# EAGLE schematic RPI 4B HAT schematic (EAGLE 9.7.0)

## Sheet 1 of 5
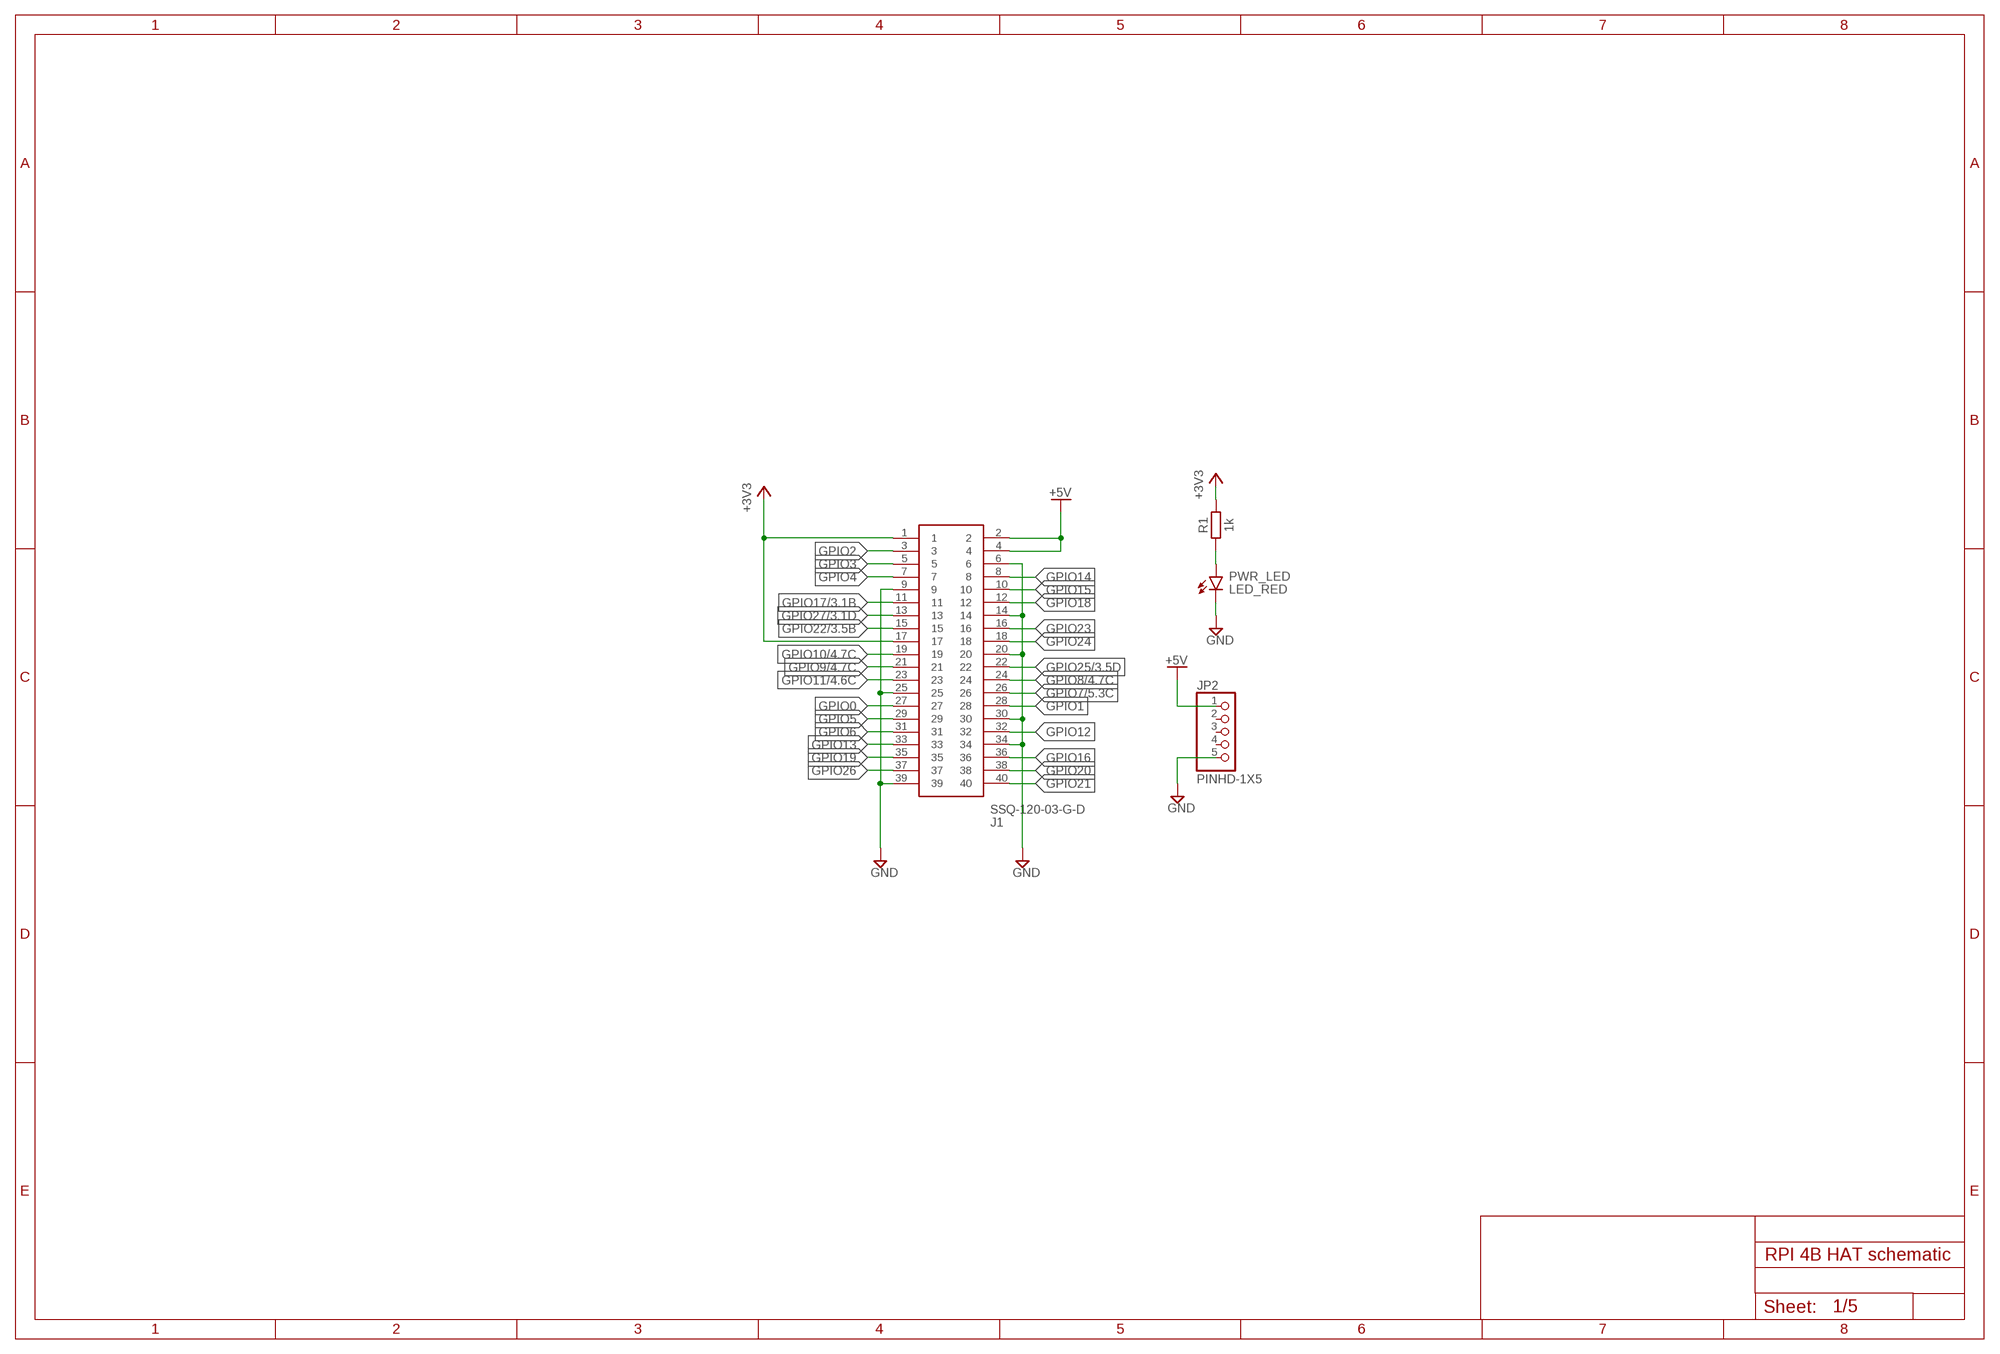
[diagram p0: schematic, sheet 1]

### Parts
J1  SSQ-120-03-G-D  [SSQ-120-XX-YYY]
JP2  PINHD-1X5  [1X05]
PWR_LED  LED_RED  CHIP-FLAT-R_1206  [LEDC3216X75N_FLAT-R]
R1  1k  RESISTOR__CHIP-1206(3216-METRIC)  [RESC3216X70]

### Nets
+3V3: J1.1 J1.17 R1.2
+5V: J1.2 J1.4 JP2.1 ; also sheet 2,3,4,5
GND: J1.6 J1.9 J1.14 J1.20 J1.25 J1.30 J1.34 J1.39 JP2.5 PWR_LED.C ; also sheet 2,3,4,5
GPIO0: J1.27
GPIO1: J1.28
GPIO2: J1.3
GPIO3: J1.5
GPIO4: J1.7
GPIO5: J1.29
GPIO6: J1.31
GPIO7: J1.26 ; also sheet 5
GPIO8: J1.24 ; also sheet 4
GPIO9: J1.21 ; also sheet 4
GPIO10: J1.19 ; also sheet 4,5
GPIO11: J1.23 ; also sheet 4,5
GPIO12: J1.32
GPIO13: J1.33
GPIO14: J1.8
GPIO15: J1.10
GPIO16: J1.36
GPIO17: J1.11 ; also sheet 3
GPIO18: J1.12
GPIO19: J1.35
GPIO20: J1.38
GPIO21: J1.40
GPIO22: J1.15 ; also sheet 3
GPIO23: J1.16
GPIO24: J1.18
GPIO25: J1.22 ; also sheet 3
GPIO26: J1.37
GPIO27: J1.13 ; also sheet 3
N$5: PWR_LED.A R1.1
Unconnected: JP2.2 JP2.3 JP2.4

## Sheet 2 of 5
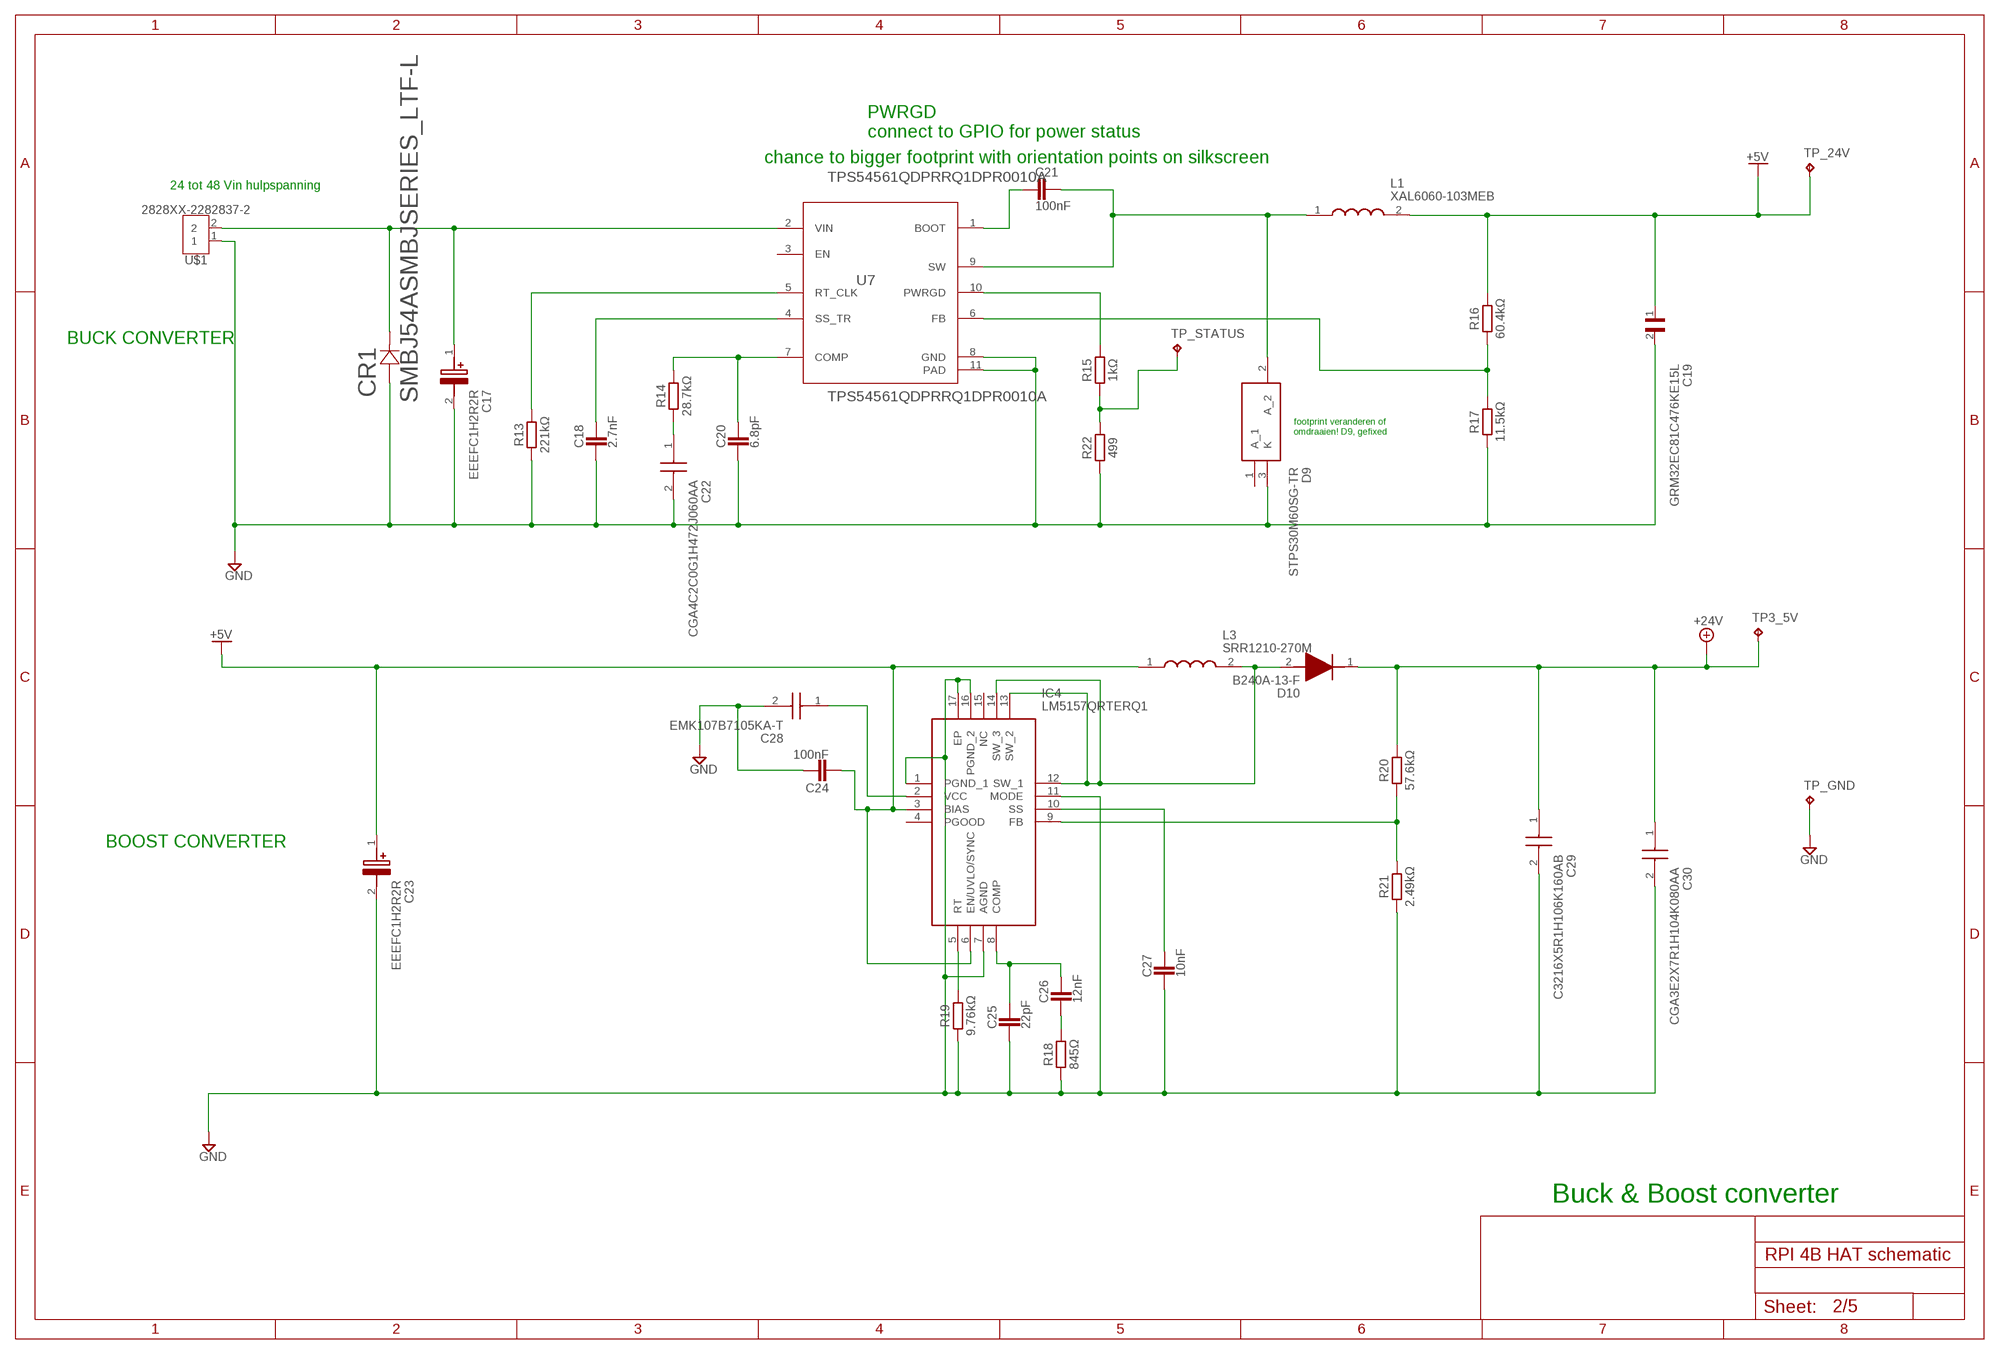
[diagram p1: schematic, sheet 2]

### Parts
C17  EEEFC1H2R2R  [EEE1AA220WR]
C18  2.7nF  CAPACITOR_CHIP-1206(3216-METRIC)  [CAPC3216X135]
C19  GRM32EC81C476KE15L  [CAPC3225X270N]
C20  6.8pF  CAPACITOR_CHIP-1206(3216-METRIC)  [CAPC3216X135]
C21  100nF  CAPACITOR_CHIP-1206(3216-METRIC)  [CAPC3216X135]
C22  CGA4C2C0G1H472J060AA  [CAPC2012X75N]
C23  EEEFC1H2R2R  [EEE1AA220WR]
C24  100nF  CAPACITOR_CHIP-1206(3216-METRIC)  [CAPC3216X135]
C25  22pF  CAPACITOR_CHIP-1206(3216-METRIC)  [CAPC3216X135]
C26  12nF  CAPACITOR_CHIP-1206(3216-METRIC)  [CAPC3216X135]
C27  10nF  CAPACITOR_CHIP-1206(3216-METRIC)  [CAPC3216X135]
C28  EMK107B7105KA-T  [CAPC1608X90N]
C29  C3216X5R1H106K160AB  [CAPC3216X180N]
C30  CGA3E2X7R1H104K080AA  [CAPC1608X90N]
CR1  SMBJ54ASMBJSERIES_LTF-L  [SMBJSERIES_LTF-L]
D9  STPS30M60SG-TR  [T1210T8G]
D10  B240A-13-F  [DIOM5226X230N]
IC4  LM5157QRTERQ1  [QFN50P300X300X80-17N]
L1  XAL6060-103MEB  [XAL6060-103MEB]
L3  SRR1210-270M  [SRR1210]
R13  221kΩ  RESISTOR__CHIP-1206(3216-METRIC)  [RESC3216X70]
R14  28.7kΩ  RESISTOR__CHIP-1206(3216-METRIC)  [RESC3216X70]
R15  1kΩ  RESISTOR__CHIP-1206(3216-METRIC)  [RESC3216X70]
R16  60.4kΩ  RESISTOR__CHIP-1206(3216-METRIC)  [RESC3216X70]
R17  11.5kΩ  RESISTOR__CHIP-1206(3216-METRIC)  [RESC3216X70]
R18  845Ω  RESISTOR__CHIP-1206(3216-METRIC)  [RESC3216X70]
R19  9.76kΩ  RESISTOR__CHIP-1206(3216-METRIC)  [RESC3216X70]
R20  57.6kΩ  RESISTOR__CHIP-1206(3216-METRIC)  [RESC3216X70]
R21  2.49kΩ  RESISTOR__CHIP-1206(3216-METRIC)  [RESC3216X70]
R22  499  RESISTOR__CHIP-1206(3216-METRIC)  [RESC3216X70]
TP3_5V  TPB1,27  [B1,27]
TP_24V  TPB1,27  [B1,27]
TP_GND  TPB1,27  [B1,27]
TP_STATUS  TPB1,27  [B1,27]
U7  TPS54561QDPRRQ1DPR0010A  [DPR0010A]
U$1  2828XX-2282837-2  [TERMBLK_508-2N]

### Nets
+5V: C19.1 C23.1(+) C24.2 IC4.3(BIAS) IC4.6(EN/UVLO/SYNC) L1.2 L3.1 R16.2 TP_24V.TP ; also sheet 1,3,4,5
+24V: C29.1 C30.1 D10.1(K) R20.2 TP3_5V.TP ; also sheet 3,4
GND: C17.2(-) C18.2 C19.2 C20.2 C22.2 C23.2(-) C24.1 C25.2 C27.2 C28.2 C29.2 C30.2 CR1.2 D9.3(K) IC4.1(PGND_1) IC4.7(AGND) IC4.11(MODE) IC4.16(PGND_2) IC4.17(EP) R13.1 R17.1 R18.1 R19.1 R21.1 R22.1 TP_GND.TP U7.8(GND) U7.11(PAD) U$1.1 ; also sheet 1,3,4,5
N$22: C17.1(+) CR1.1 U7.2(VIN) U$1.2
N$23: R13.2 U7.5(RT_CLK)
N$24: C18.1 U7.4(SS_TR)
N$25: C22.1 R14.1
N$26: C20.1 R14.2 U7.7(COMP)
N$27: C21.2 U7.1(BOOT)
N$28: C21.1 D9.2(A_2) L1.1 U7.9(SW)
N$29: R15.2 U7.10(PWRGD)
N$30: R16.1 R17.2 U7.6(FB)
N$31: C28.1 IC4.2(VCC)
N$32: C25.1 C26.1 IC4.8(COMP)
N$33: C26.2 R18.2
N$34: C27.1 IC4.10(SS)
N$35: IC4.5(RT) R19.2
N$36: D10.2(A) IC4.12(SW_1) IC4.13(SW_2) IC4.14(SW_3) L3.2
N$37: IC4.9(FB) R20.1 R21.2
N$38: R15.1 R22.2 TP_STATUS.TP
Unconnected: D9.1(A_1) IC4.4(PGOOD) IC4.15(NC) U7.3(EN)

### Notes on the sheet
- PWRGD 
  connect to GPIO for power status
- chance to bigger footprint with orientation points on silkscreen
- 24 tot 48 Vin hulpspanning
- BUCK CONVERTER
- footprint veranderen of
  omdraaien! D9, gefixed
- BOOST CONVERTER
- Buck & Boost converter

## Sheet 3 of 5
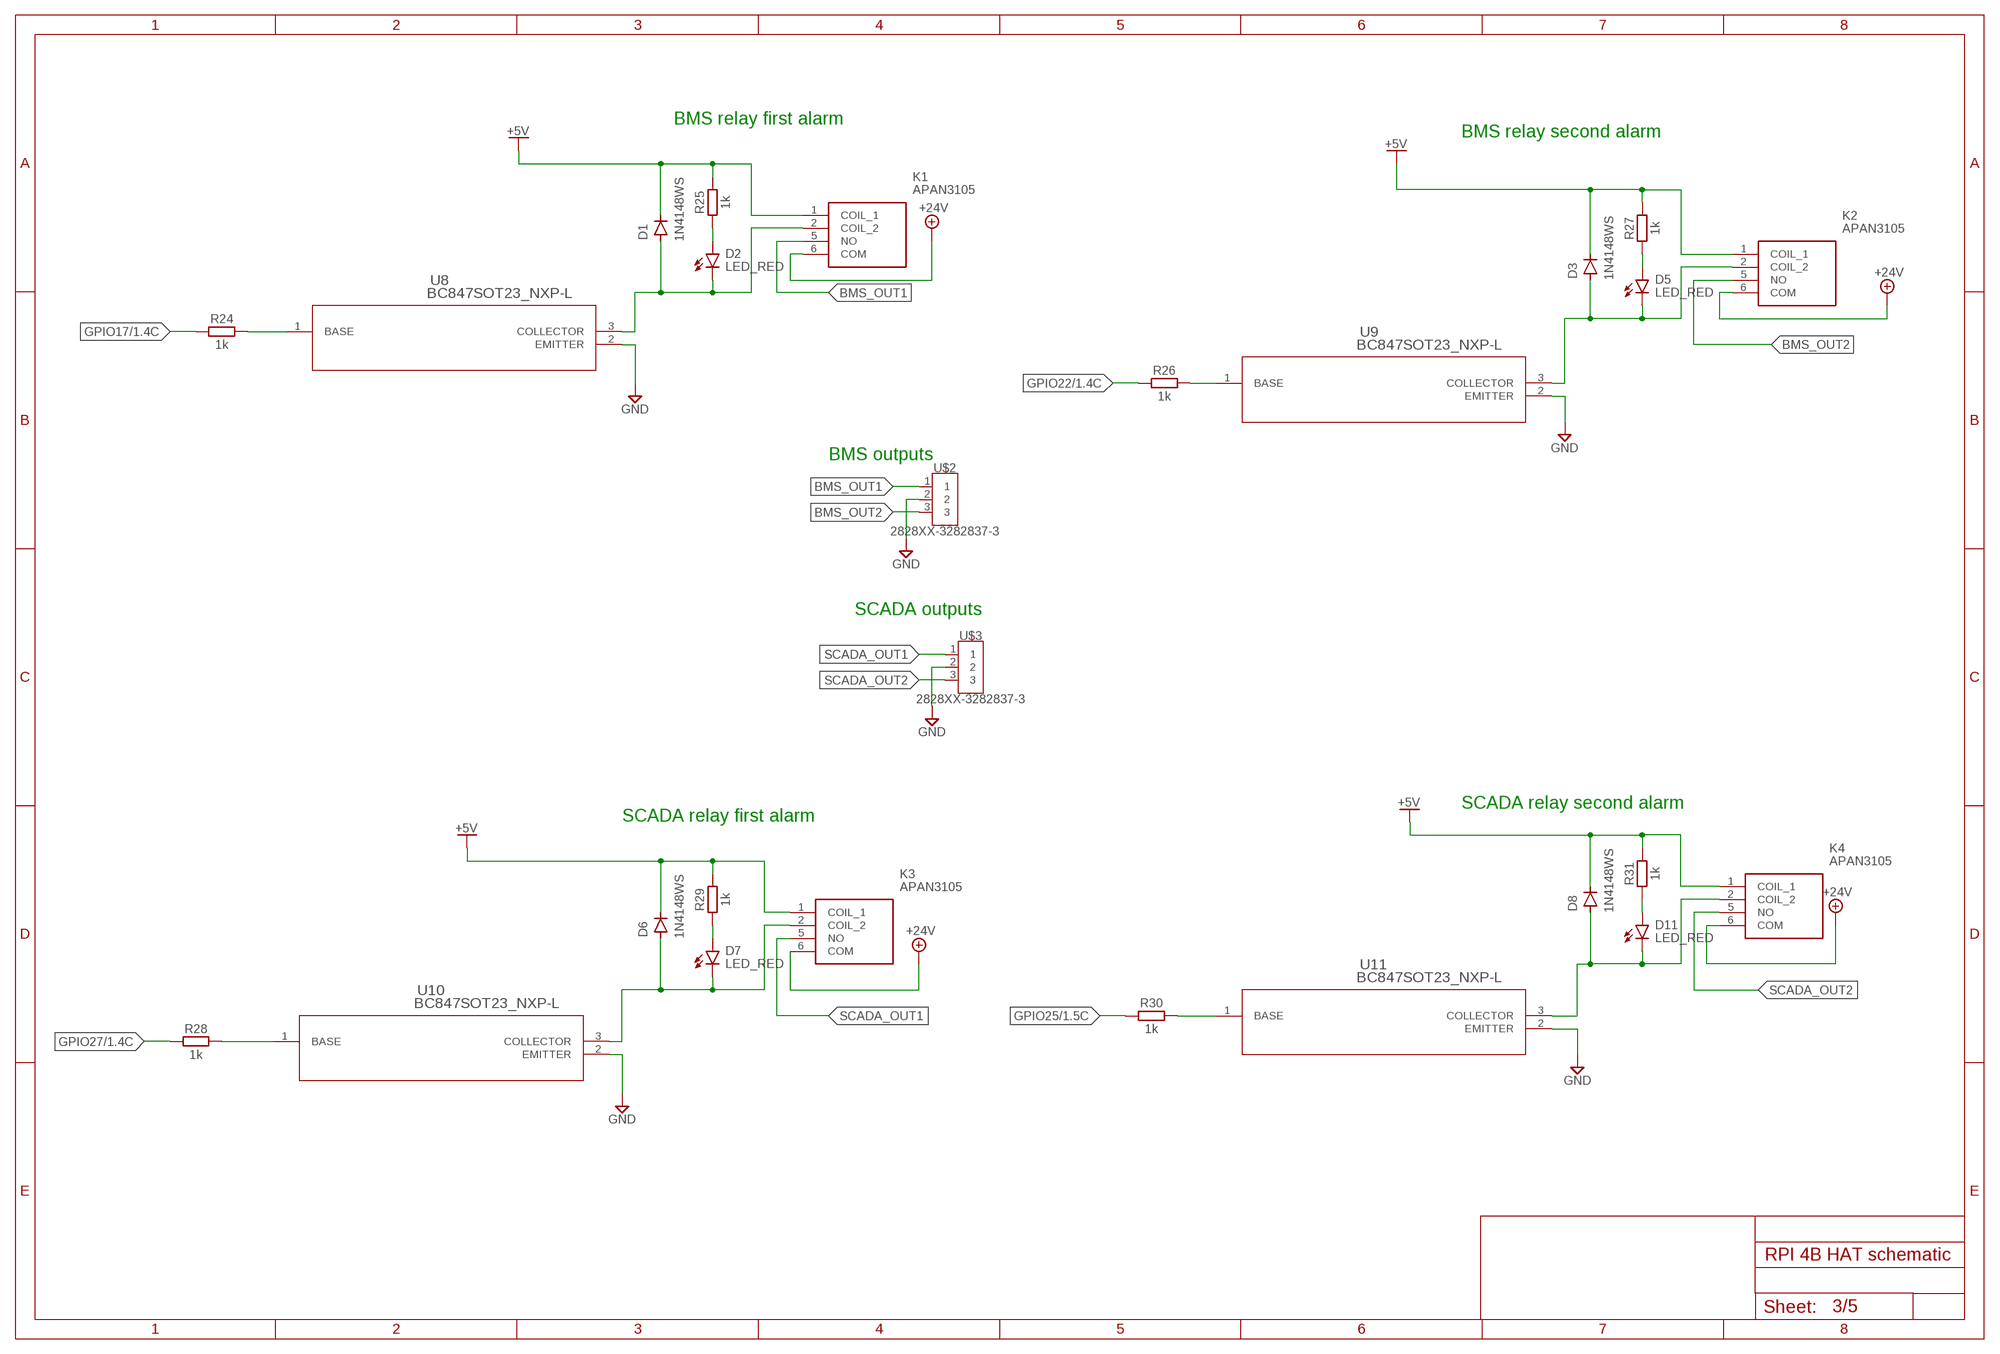
[diagram p2: schematic, sheet 3]

### Parts
D1  1N4148WS  [SOD-323]
D2  LED_RED  CHIP-FLAT-R_1206  [LEDC3216X75N_FLAT-R]
D3  1N4148WS  [SOD-323]
D5  LED_RED  CHIP-FLAT-R_1206  [LEDC3216X75N_FLAT-R]
D6  1N4148WS  [SOD-323]
D7  LED_RED  CHIP-FLAT-R_1206  [LEDC3216X75N_FLAT-R]
D8  1N4148WS  [SOD-323]
D11  LED_RED  CHIP-FLAT-R_1206  [LEDC3216X75N_FLAT-R]
K1  APAN3105  [APAN3105]
K2  APAN3105  [APAN3105]
K3  APAN3105  [APAN3105]
K4  APAN3105  [APAN3105]
R24  1k  RESISTOR__CHIP-1206(3216-METRIC)  [RESC3216X70]
R25  1k  RESISTOR__CHIP-1206(3216-METRIC)  [RESC3216X70]
R26  1k  RESISTOR__CHIP-1206(3216-METRIC)  [RESC3216X70]
R27  1k  RESISTOR__CHIP-1206(3216-METRIC)  [RESC3216X70]
R28  1k  RESISTOR__CHIP-1206(3216-METRIC)  [RESC3216X70]
R29  1k  RESISTOR__CHIP-1206(3216-METRIC)  [RESC3216X70]
R30  1k  RESISTOR__CHIP-1206(3216-METRIC)  [RESC3216X70]
R31  1k  RESISTOR__CHIP-1206(3216-METRIC)  [RESC3216X70]
U8  BC847SOT23_NXP-L  [SOT23_NXP-L]
U9  BC847SOT23_NXP-L  [SOT23_NXP-L]
U10  BC847SOT23_NXP-L  [SOT23_NXP-L]
U11  BC847SOT23_NXP-L  [SOT23_NXP-L]
U$2  2828XX-3282837-3  [TERMBLK_508-3N]
U$3  2828XX-3282837-3  [TERMBLK_508-3N]

### Nets
+5V: D1.C D3.C D6.C D8.C K1.1(COIL_1) K2.1(COIL_1) K3.1(COIL_1) K4.1(COIL_1) R25.2 R27.2 R29.2 R31.2 ; also sheet 1,2,4,5
+24V: K1.6(COM) K2.6(COM) K3.6(COM) K4.6(COM) ; also sheet 2,4
BMS_OUT1: K1.5(NO) U$2.1
BMS_OUT2: K2.5(NO) U$2.3
GND: U8.2(EMITTER) U9.2(EMITTER) U10.2(EMITTER) U11.2(EMITTER) U$2.2 U$3.2 ; also sheet 1,2,4,5
GPIO17: R24.1 ; also sheet 1
GPIO22: R26.1 ; also sheet 1
GPIO25: R30.1 ; also sheet 1
GPIO27: R28.1 ; also sheet 1
N$2: D2.A R25.1
N$19: D1.A D2.C K1.2(COIL_2) U8.3(COLLECTOR)
N$39: R24.2 U8.1(BASE)
N$40: D3.A D5.C K2.2(COIL_2) U9.3(COLLECTOR)
N$41: D5.A R27.1
N$42: R26.2 U9.1(BASE)
N$43: D6.A D7.C K3.2(COIL_2) U10.3(COLLECTOR)
N$44: D7.A R29.1
N$45: R28.2 U10.1(BASE)
N$46: D8.A D11.C K4.2(COIL_2) U11.3(COLLECTOR)
N$47: D11.A R31.1
N$48: R30.2 U11.1(BASE)
SCADA_OUT1: K3.5(NO) U$3.1
SCADA_OUT2: K4.5(NO) U$3.3

### Notes on the sheet
- BMS relay first alarm
- BMS relay second alarm
- BMS outputs
- SCADA outputs
- SCADA relay second alarm
- SCADA relay first alarm

## Sheet 4 of 5
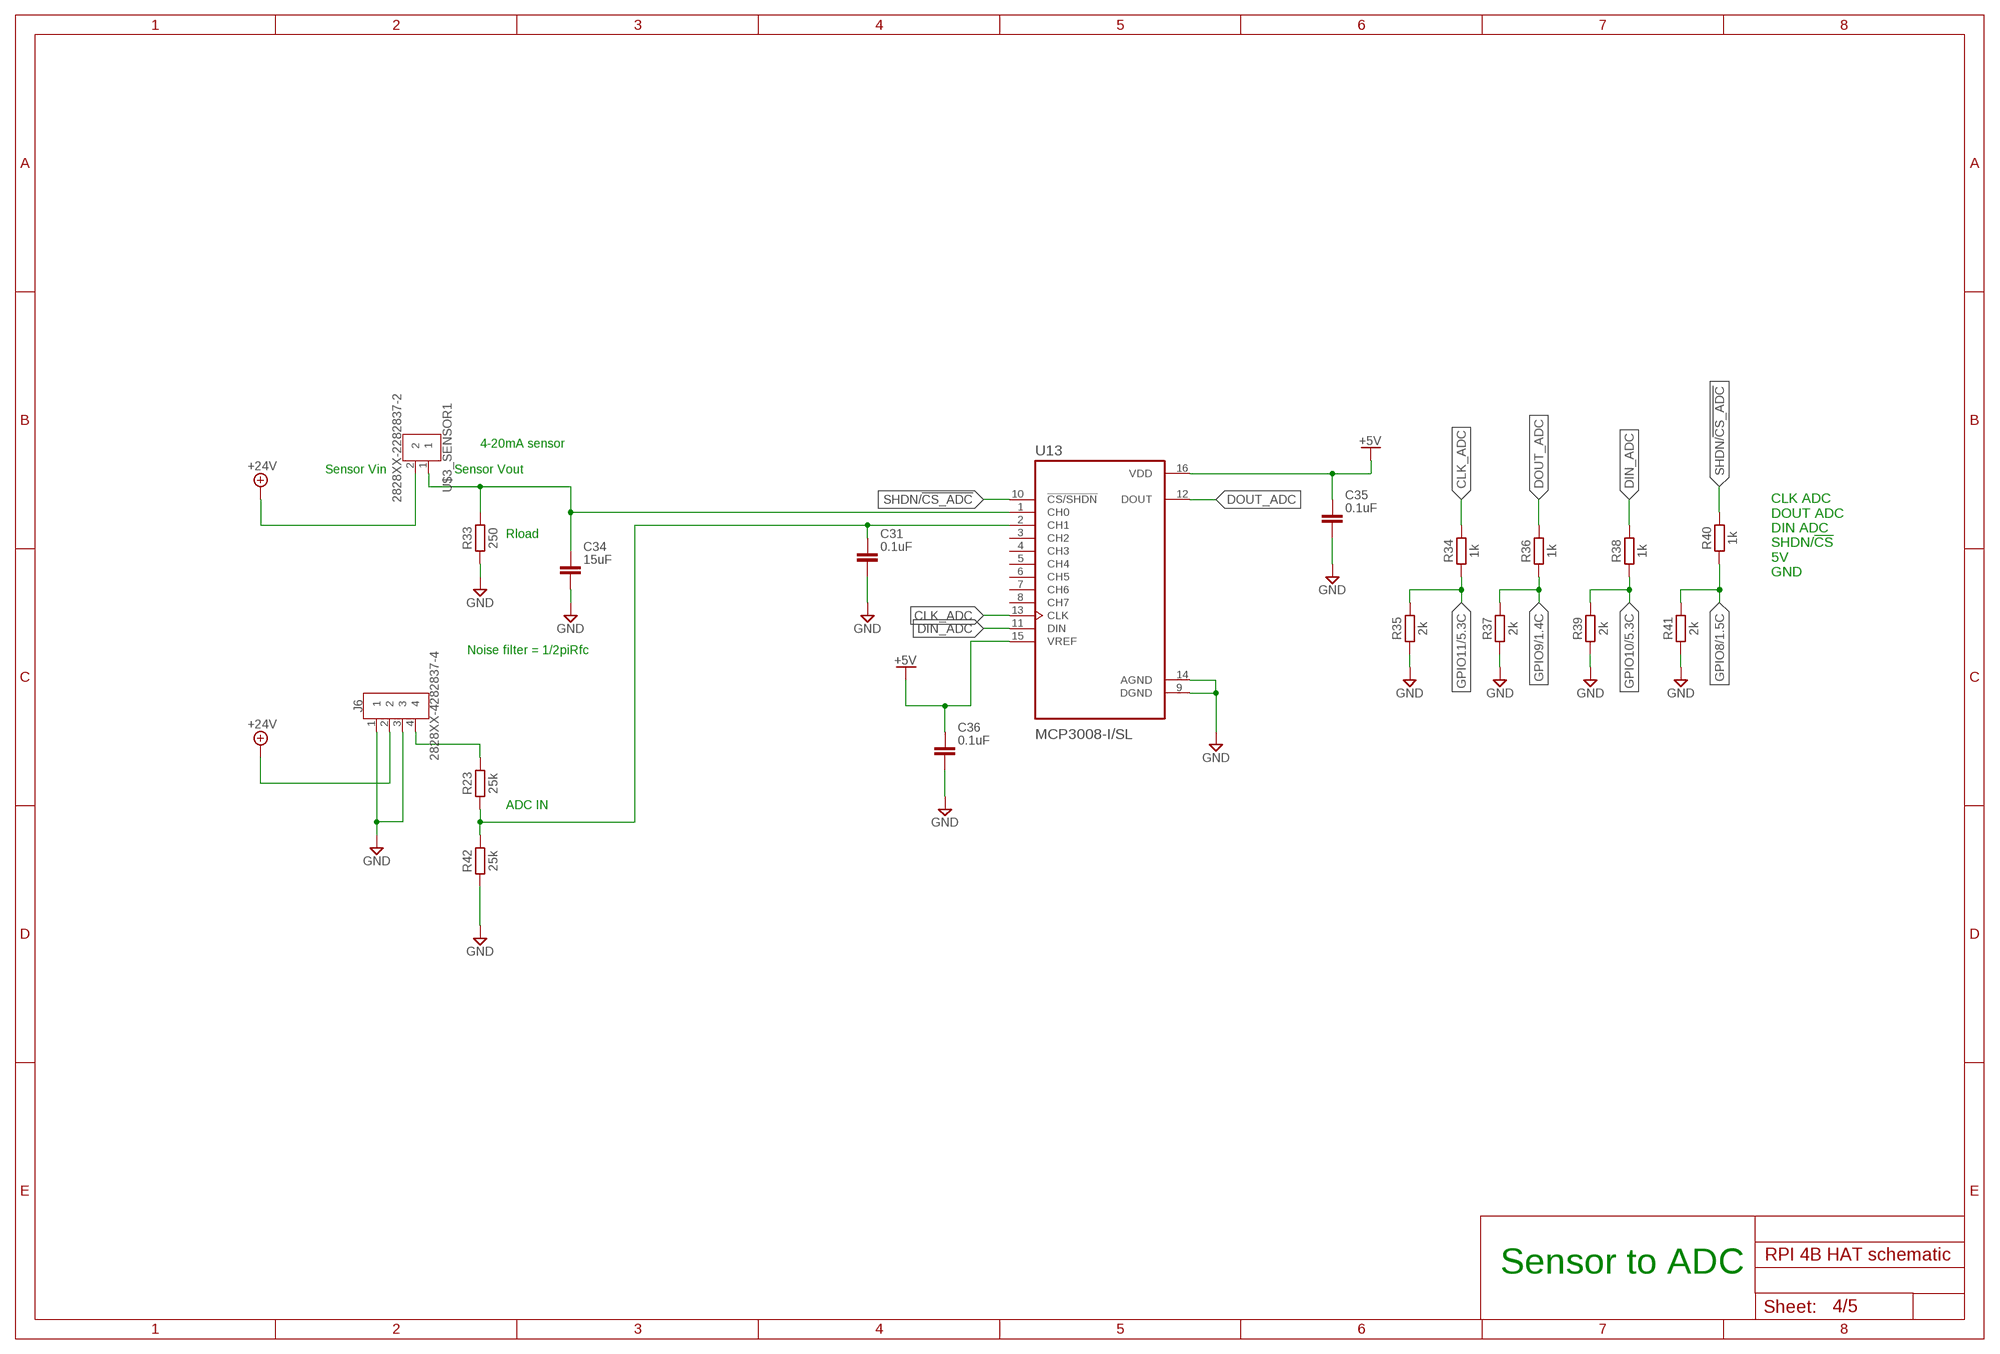
[diagram p3: schematic, sheet 4]

### Parts
C31  0.1uF  C_CHIP-1206(3216-METRIC)  [CAPC3216X135]
C34  15uF  C_CHIP-1206(3216-METRIC)  [CAPC3216X135]
C35  0.1uF  C_CHIP-1206(3216-METRIC)  [CAPC3216X135]
C36  0.1uF  C_CHIP-1206(3216-METRIC)  [CAPC3216X135]
J6  2828XX-4282837-4  [TERMBLK_508-4N]
R23  25k  RESISTOR__CHIP-1206(3216-METRIC)  [RESC3216X70]
R33  250  RESISTOR__CHIP-1206(3216-METRIC)  [RESC3216X70]
R34  1k  RESISTOR__CHIP-1206(3216-METRIC)  [RESC3216X70]
R35  2k  RESISTOR__CHIP-1206(3216-METRIC)  [RESC3216X70]
R36  1k  RESISTOR__CHIP-1206(3216-METRIC)  [RESC3216X70]
R37  2k  RESISTOR__CHIP-1206(3216-METRIC)  [RESC3216X70]
R38  1k  RESISTOR__CHIP-1206(3216-METRIC)  [RESC3216X70]
R39  2k  RESISTOR__CHIP-1206(3216-METRIC)  [RESC3216X70]
R40  1k  RESISTOR__CHIP-1206(3216-METRIC)  [RESC3216X70]
R41  2k  RESISTOR__CHIP-1206(3216-METRIC)  [RESC3216X70]
R42  25k  RESISTOR__CHIP-1206(3216-METRIC)  [RESC3216X70]
U13  MCP3008-I/SL  [SOIC127P600X175-16N]
U$3_SENSOR1  2828XX-2282837-2  [TERMBLK_508-2N]

### Nets
+5V: C35.1 C36.1 U13.15(VREF) U13.16(VDD) ; also sheet 1,2,3,5
+24V: J6.2 U$3_SENSOR1.2 ; also sheet 2,3
CLK_ADC: R34.2 U13.13(CLK)
DIN_ADC: R38.2 U13.11(DIN)
DOUT_ADC: R36.2 U13.12(DOUT)
GND: C31.2 C34.2 C35.2 C36.2 J6.1 J6.3 R33.1 R35.1 R37.1 R39.1 R41.1 R42.1 U13.9(DGND) U13.14(AGND) ; also sheet 1,2,3,5
GPIO8: R40.1 R41.2 ; also sheet 1
GPIO9: R36.1 R37.2 ; also sheet 1
GPIO10: R38.1 R39.2 ; also sheet 1,5
GPIO11: R34.1 R35.2 ; also sheet 1,5
N$1: J6.4 R23.2
N$20: C34.1 R33.2 U13.1(CH0) U$3_SENSOR1.1
N$56: C31.1 R23.1 R42.2 U13.2(CH1)
SHDN/!CS_ADC: R40.2 U13.10(!CS/SHDN)
Unconnected: U13.3(CH2) U13.4(CH3) U13.5(CH4) U13.6(CH5) U13.7(CH6) U13.8(CH7)

### Notes on the sheet
- 4-20mA sensor
- Sensor Vin | Sensor Vout
- Rload
- CLK ADC
  DOUT ADC
  DIN ADC
  SHDN/!CS
  5V
  GND
- Noise filter = 1/2piRfc
- ADC IN
- Sensor to ADC

## Sheet 5 of 5
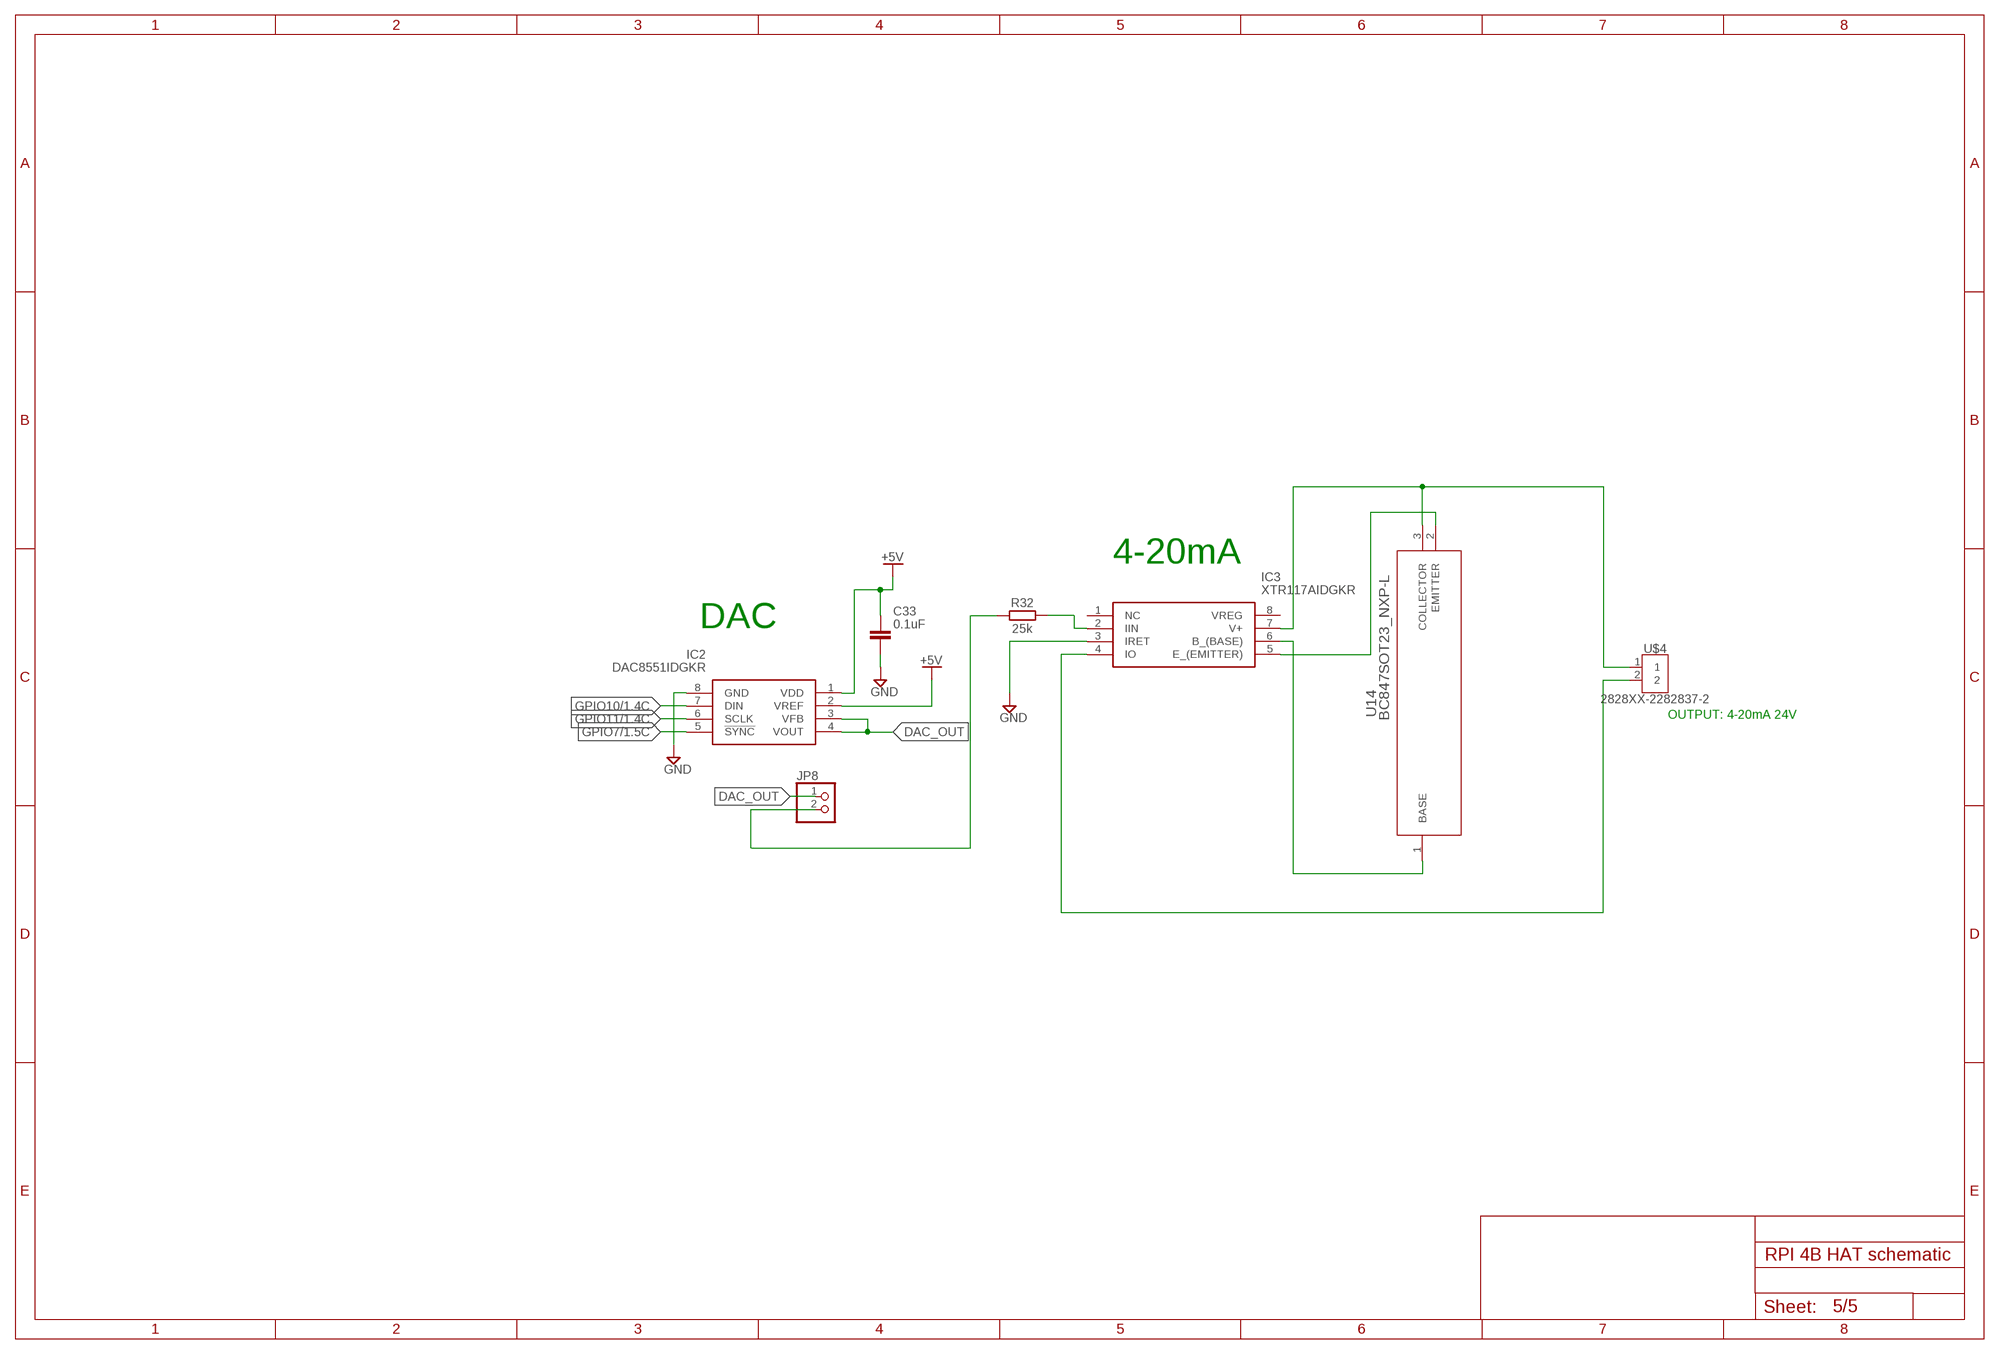
[diagram p4: schematic, sheet 5]

### Parts
C33  0.1uF  C_CHIP-1206(3216-METRIC)  [CAPC3216X135]
IC2  DAC8551IDGKR  [SOP65P490X110-8N]
IC3  XTR117AIDGKR  [SOP65P490X110-8N]
JP8  PINHD-1X2  [1X02]
R32  25k  RESISTOR__CHIP-1206(3216-METRIC)  [RESC3216X70]
U14  BC847SOT23_NXP-L  [SOT23_NXP-L]
U$4  2828XX-2282837-2  [TERMBLK_508-2N]

### Nets
+5V: C33.1 IC2.1(VDD) IC2.2(VREF) ; also sheet 1,2,3,4
DAC_OUT: IC2.3(VFB) IC2.4(VOUT) JP8.1
GND: C33.2 IC2.8(GND) IC3.3(IRET) ; also sheet 1,2,3,4
GPIO7: IC2.5(!SYNC) ; also sheet 1
GPIO10: IC2.7(DIN) ; also sheet 1,4
GPIO11: IC2.6(SCLK) ; also sheet 1,4
N$3: IC3.4(IO) U$4.2
N$4: IC3.7(V+) U14.3(COLLECTOR) U$4.1
N$49: IC3.5(E_(EMITTER)) U14.2(EMITTER)
N$50: IC3.6(B_(BASE)) U14.1(BASE)
N$51: JP8.2 R32.1
N$52: IC3.2(IIN) R32.2
Unconnected: IC3.1(NC) IC3.8(VREG)

### Notes on the sheet
- 4-20mA
- DAC
- OUTPUT: 4-20mA 24V

## Library data of the parts
C17 C23 = EEEFC1H2R2R:EEEFC1H2R2R: Panasonic 2.2uF 50V dc Aluminium Electrolytic Capacitor, Surface Mount 4 (Dia.) x 5.4mm +105C 4mm Source: Datasheet <http://industrial.panasonic.com/cdbs/www-data/pdf/RDE0000/ABA0000C1172.pdf>; DESCRIPTION: Panasonic 2.2uF 50V dc Aluminium Electrolytic Capacitor, Surface Mount 4 (Dia.) x 5.4mm +105C 4mm; HEIGHT: 5.5mm; MANUFACTURER_NAME: Panasonic; MANUFACTURER_PART_NUMBER: EEEFC1H2R2R
C18 C20 C21 C24-C27 = Tinkercad:CAPACITOR: Capacitor - Generic; CATEGORY: Capacitor
C19 = GRM32EC81C476KE15L:GRM32EC81C476KE15L: SMD Capacitor X6S(EIA) with Capacitance: 47uF Tol. 10%. Rated Voltage: 16Vdc Check availability <https://pricing.snapeda.com/parts/GRM32EC81C476KE15L/Murata%20Electronics/view-part?ref=eda>; AVAILABILITY: In Stock; CHECK_PRICES: https://www.snapeda.com/parts/GRM32EC81C476KE15L/Murata/view-part/?ref=eda; DESCRIPTION: 47 µF ±10% 16V Ceramic Capacitor X6S 1210 (3225 Metric); MF: Murata Electronics; MP: GRM32EC81C476KE15L; PACKAGE: 3225 Murata; PRICE: None; SNAPEDA_LINK: https://www.snapeda.com/parts/GRM32EC81C476KE15L/Murata/view-part/?ref=snap
C22 = CGA4C2C0G1H472J060AA:CGA4C2C0G1H472J060AA: Multilayer Ceramic Chip Capacitors, Capacitance=4.7nF, LxWxT:2x1.25x0.6mm Source: Datasheet; DESCRIPTION: Multilayer Ceramic Chip Capacitors, Capacitance=4.7nF, LxWxT:2x1.25x0.6mm; HEIGHT: 0.75mm; MANUFACTURER_NAME: TDK; MANUFACTURER_PART_NUMBER: CGA4C2C0G1H472J060AA; MOUSER_PART_NUMBER: 810-CGA4C2C0G1H472J; MOUSER_PRICE-STOCK: https://www.mouser.co.uk/ProductDetail/TDK/CGA4C2C0G1H472J060AA?qs=FxQuwy19cyCgdYzJw5%252BHfA%3D%3D
C28 = EMK107B7105KA-T:EMK107B7105KA-T: Ceramic Capacitor 0603 16V 1uF Source: Datasheet <https://componentsearchengine.com/Datasheets/1/EMK107B7105KA-T.pdf>; DESCRIPTION: Ceramic Capacitor 0603 16V 1uF; HEIGHT: 0.9mm; MANUFACTURER_NAME: TAIYO YUDEN; MANUFACTURER_PART_NUMBER: EMK107B7105KA-T; MOUSER_PART_NUMBER: 963-EMK107B7105KA-T; MOUSER_PRICE-STOCK: https://www.mouser.co.uk/ProductDetail/TAIYO-YUDEN/EMK107B7105KA-T?qs=I6KAKw0tg2zS1zj87Lm%2FxQ%3D%3D
C29 = C3216X5R1H106K160AB:C3216X5R1H106K160AB: 1206 X5R ceramic capacitor 10uF 50V TDK 1206 C 10F Ceramic Multilayer Capacitor, 50 V dc X5R Dielectric +/-10% SMD Source: Datasheet <https://product.tdk.com/info/en/catalog/datasheets/mlcc_commercial_midvoltage_en.pdf>; DESCRIPTION: 1206 X5R ceramic capacitor 10uF 50V TDK 1206 C 10F Ceramic Multilayer Capacitor, 50 V dc X5R Dielectric +/-10% SMD; HEIGHT: 1.8mm; MANUFACTURER_NAME: TDK; MANUFACTURER_PART_NUMBER: C3216X5R1H106K160AB; MOUSER_PART_NUMBER: 810-C3216X5R1H106K; MOUSER_PRICE-STOCK: https://www.mouser.co.uk/ProductDetail/TDK/C3216X5R1H106K160AB?qs=NRhsANhppD%252BLHMbxvQzsEQ%3D%3D
C30 = CGA3E2X7R1H104K080AA:CGA3E2X7R1H104K080AA: Multilayer Ceramic Chip Capacitors, Capacitance=0.1uF, LxWxT:1.6x0.8x0.8mm Source: Datasheet; DESCRIPTION: Multilayer Ceramic Chip Capacitors, Capacitance=0.1uF, LxWxT:1.6x0.8x0.8mm; HEIGHT: 0.9mm; MANUFACTURER_NAME: TDK; MANUFACTURER_PART_NUMBER: CGA3E2X7R1H104K080AA; MOUSER_PART_NUMBER: 810-CGA3E2X7R1H104K; MOUSER_PRICE-STOCK: https://www.mouser.co.uk/ProductDetail/TDK/CGA3E2X7R1H104K080AA?qs=NRhsANhppD%2Fge2a869G9Fg%3D%3D
C31 C33-C36 = Capacitor:C: Capacitor - Generic; CATEGORY: Capacitor
CR1 = 2024-04-09_15-45-34_Library:SMBJ54A; COPYRIGHT: Copyright (C) 2024 Ultra Librarian. All rights reserved.; MANUFACTURER_PART_NUMBER: SMBJ54A; MFR_NAME: Littelfuse Inc
D1 D3 D6 D8 = Diodes:1N4148WS: DIODE GEN PURP 75V 150MA SOD323F Manufacturer's datasheet <https://www.onsemi.com/pub/Collateral/1N914BWS-D.pdf>; CREATED_BY: PCBLayout.com; DIGIKEY_PART_NUMBER: 1N4148WSFSTR-ND; MANUFACTURER: Diodes Incorporated; MPN: 1N4148WS; PACKAGE: SOD-323
D2 D5 D7 D11 PWR_LED = LED:CHIP-FLAT-R; CATEGORY: LED; COLOR: RED; DESCRIPTION: CHIP LED FLAT; SUB-CATEGORY: CHIP; TYPE: FLAT_TOP
D9 = STPS30M60SG-TR:STPS30M60SG-TR: STMicroelectronics STPS30M60SG-TR, SMT Schottky Diode, 60V 30A, 3-Pin D2PAK Source: Datasheet <https://componentsearchengine.com/Datasheets/1/STPS30M60SG-TR.pdf>; DESCRIPTION: STMicroelectronics STPS30M60SG-TR, SMT Schottky Diode, 60V 30A, 3-Pin D2PAK; HEIGHT: 4mm; MANUFACTURER_NAME: STMicroelectronics; MANUFACTURER_PART_NUMBER: STPS30M60SG-TR; MOUSER_PART_NUMBER: 511-STPS30M60SG-TR; MOUSER_PRICE-STOCK: https://www.mouser.co.uk/ProductDetail/STMicroelectronics/STPS30M60SG-TR?qs=G49gCGQm93g67AcseEWC2A%3D%3D
D10 = B240A-13-F:B240A-13-F: Schottky Diode 2A 40V 0.5Vf SMA Diodes Inc B240A-13-F, SMT Schottky Diode, 40V 2A, 2-Pin DO-214AC Source: Datasheet <https://datasheet.datasheetarchive.com/originals/distributors/SFDatasheet-0/sf-0003166.pdf>; DESCRIPTION: Schottky Diode 2A 40V 0.5Vf SMA Diodes Inc B240A-13-F, SMT Schottky Diode, 40V 2A, 2-Pin DO-214AC; HEIGHT: 2.3mm; MANUFACTURER_NAME: Diodes Incorporated; MANUFACTURER_PART_NUMBER: B240A-13-F; MOUSER_PART_NUMBER: 621-B240A-F; MOUSER_PRICE-STOCK: https://www.mouser.co.uk/ProductDetail/Diodes-Incorporated/B240A-13-F?qs=idJYQZufS6jleWUCPMvVdQ%3D%3D
IC2 = DAC8551IDGKR:DAC8551IDGKR: 16-Bit, Ultralow Glitch, Voltage Output, Digital to Analog Converter Source: Datasheet <http://www.ti.com/lit/gpn/DAC8551>; DESCRIPTION: 16-Bit, Ultralow Glitch, Voltage Output, Digital to Analog Converter; HEIGHT: 1.1mm; MANUFACTURER_NAME: Texas Instruments; MANUFACTURER_PART_NUMBER: DAC8551IDGKR; MOUSER_PART_NUMBER: 595-DAC8551IDGKR; MOUSER_PRICE-STOCK: https://www.mouser.co.uk/ProductDetail/Texas-Instruments/DAC8551IDGKR?qs=vul0MlC%2Fa1dStr8sTUNGkA%3D%3D
IC3 = XTR117AIDGKR:XTR117AIDGKR: Sensor Interface XTR117 4-20mA Crnt Loop Transmitter Source: Datasheet <http://www.ti.com/lit/ds/symlink/xtr117.pdf>; DESCRIPTION: Sensor Interface XTR117 4-20mA Crnt Loop Transmitter; HEIGHT: 1.1mm; MANUFACTURER_NAME: Texas Instruments; MANUFACTURER_PART_NUMBER: XTR117AIDGKR; MOUSER_PART_NUMBER: 595-XTR117AIDGKR; MOUSER_PRICE-STOCK: https://www.mouser.co.uk/ProductDetail/Texas-Instruments/XTR117AIDGKR?qs=zqbRmZ%252BfZD%252BYMdmF%252BmhQwg%3D%3D
IC4 = LM5157QRTERQ1:LM5157QRTERQ1: Switching Voltage Regulators 6-A, 50-V, 2.2-MHz wide VIN boost, flyback, & SEPIC converter with dual random spread spectrum Source: Datasheet <https://pdf1.alldatasheet.com/datasheet-pdf/view/1264204/TI/LM5157QRTERQ1.html>; DESCRIPTION: Switching Voltage Regulators 6-A, 50-V, 2.2-MHz wide VIN boost, flyback, & SEPIC converter with dual random spread spectrum; HEIGHT: 0.8mm; MANUFACTURER_NAME: Texas Instruments; MANUFACTURER_PART_NUMBER: LM5157QRTERQ1; MOUSER_PART_NUMBER: 595-LM5157QRTERQ1; MOUSER_PRICE-STOCK: https://www.mouser.co.uk/ProductDetail/Texas-Instruments/LM5157QRTERQ1?qs=QNEnbhJQKvb8%252BoI1%252BJEaeg%3D%3D
J1 = SSQ-120-03-G-D:SSQ-120-03-G-D: 40 Position, .100" Tiger Buy™ Socket Strip, Square Tail Source: Datasheet <http://suddendocs.samtec.com/prints/ssq-1xx-xx-xxx-x-xx-xxx-xx-x-mkt.pdf>; DESCRIPTION: 40 Position, .100&quot; Tiger Buy&trade; Socket Strip, Square Tail; HEIGHT: mm; MANUFACTURER_NAME: SAMTEC; MANUFACTURER_PART_NUMBER: SSQ-120-03-G-D; MOUSER_PART_NUMBER: 200-SSQ12003GD; MOUSER_PRICE-STOCK: https://www.mouser.co.uk/ProductDetail/Samtec/SSQ-120-03-G-D?qs=rU5fayqh%252BE0nmWFGK5lT6g%3D%3D
J6 = Connector:2828XX-4: 4 Position Wire to Board Terminal Block Horizontal with Board Datasheet <https://www.te.com.cn/commerce/DocumentDelivery/DDEController?Action=showdoc&DocId=Catalog+Section%7F1308389_EUROSTYLE_TERMINAL_BLOCKS%7F0607%7Fpdf%7FEnglish%7FENG_CS_1308389_EUROSTYLE_TERMINAL_BLOCKS_0607.pdf%7F2-282837-5>; CATEGORY: Fixed Terminal Blocks; DATASHEET: https://www.te.com/usa-en/product-282837-4.datasheet.pdf; DESCRIPTION: 4 Position Wire to Board Terminal Block Horizontal with Board 0.200" (5.08mm) Through Hole; MANUFACTURER: TE Connectivity AMP Connectors; MPN: 282837-4; OPERATING_TEMPERATURE: -40°C ~ 105°C; PACKAGE_SIZE: NA; PACKAGE_TYPE: THT; PART_STATUS: ACTIVE; PITCH: 0.200" (5.08mm); ROHS: COMPLIANT; SERIES: Buchanan; SUBCATEGORY: Terminal Blocks; TYPE: Through Hole Screw - Rising Cage Clamp Side wire entry Horizontal with Board
JP2 = Connector:PINHD-1X5: PIN HEADER; CATEGORY: Headers; DESCRIPTION: Header-Straight-5 Position; PACKAGE_TYPE: THT; PITCH: 0.100" (2.54mm); SUBCATEGORY: Headers-Male Pins; TYPE: Board to Board or Cable-Unshrouded-Through Hole-Straight
JP8 = pinhead:PINHD-1X2: PIN HEADER
K1-K4 = APAN3105:APAN3105: Panasonic SPNO PCB Mount Non-Latching Relay, 5V dc Coil 5 A Non-Latching Relay Source: Datasheet <https://datasheet.datasheetarchive.com/originals/distributors/DKDS40/DSANUWW004619.pdf>; DESCRIPTION: Panasonic SPNO PCB Mount Non-Latching Relay, 5V dc Coil 5 A Non-Latching Relay; HEIGHT: 12mm; MANUFACTURER_NAME: Panasonic; MANUFACTURER_PART_NUMBER: APAN3105; MOUSER_PART_NUMBER: 769-APAN3105; MOUSER_PRICE-STOCK: https://www.mouser.co.uk/ProductDetail/Panasonic-Industrial-Devices/APAN3105?qs=WfzemSix46txUgv3897GSA%3D%3D
L1 = XAL6060-103MEB:XAL6060-103MEB: Fixed Inductors XAL6060 High Current 10 uH 20% 7 A Compos Source: Datasheet; DESCRIPTION: Fixed Inductors XAL6060 High Current 10 uH 20% 7 A Compos; HEIGHT: mm; MANUFACTURER_NAME: COILCRAFT; MANUFACTURER_PART_NUMBER: XAL6060-103MEB; MOUSER_PART_NUMBER: 994-XAL6060-103MEB; MOUSER_PRICE-STOCK: https://www.mouser.co.uk/ProductDetail/Coilcraft/XAL6060-103MEB?qs=VJjuEbE9QBODk8cxO8T25A%3D%3D
L3 = SRR1210-270M:SRR1210-270M: Bourns SRR1210 Series Type 1210 Shielded Wire-wound SMD Inductor with a Ferrite Core, 27 uH +/-20% Wire-Wound 5A Idc Source: Datasheet <https://www.bourns.com/docs/Product-Datasheets/SRR1210.pdf>; DESCRIPTION: Bourns SRR1210 Series Type 1210 Shielded Wire-wound SMD Inductor with a Ferrite Core, 27 uH +/-20% Wire-Wound 5A Idc; HEIGHT: mm; MANUFACTURER_NAME: Bourns; MANUFACTURER_PART_NUMBER: SRR1210-270M; MOUSER_PART_NUMBER: 652-SRR1210-270M; MOUSER_PRICE-STOCK: https://www.mouser.co.uk/ProductDetail/Bourns/SRR1210-270M?qs=4vvWAaIu%2Fq78Cj5nf%2FUfqQ%3D%3D
R1 R13-R42 = Tinkercad:RESISTOR: Resistor Fixed - Generic; CATEGORY: Resistor; SUB-CATEGORY: Fixed
TP3_5V TP_24V TP_GND TP_STATUS = testpad:TP: Test pad
U7 = 2024-10-11_09-28-41_Library:TPS54561QDPRRQ1; COPYRIGHT: Copyright (C) 2024 Ultra Librarian. All rights reserved.; MANUFACTURER_PART_NUMBER: TPS54561QDPRRQ1; MFR_NAME: Texas Instruments; REFDES: RefDes; TYPE: TYPE
U8-U11 U14 = 2024-10-31_10-28-23_Library:BC847; COPYRIGHT: Copyright (C) 2024 Ultra Librarian. All rights reserved.; MANUFACTURER_PART_NUMBER: BC847; MFR_NAME: NXP
U13 = SnapEDA Library:MCP3008-I/SL
U$1 U$3_SENSOR1 U$4 = Connector:2828XX-2: 2 Position Wire to Board Terminal Block Horizontal with Board Datasheet <https://www.te.com.cn/commerce/DocumentDelivery/DDEController?Action=showdoc&DocId=Catalog+Section%7F1308389_EUROSTYLE_TERMINAL_BLOCKS%7F0607%7Fpdf%7FEnglish%7FENG_CS_1308389_EUROSTYLE_TERMINAL_BLOCKS_0607.pdf%7F2-282837-5>; CATEGORY: Connector; DESCRIPTION: 2 Position Wire to Board Terminal Block Horizontal with Board 5.08 mm Through Hole; MANUFACTURER: TE Connectivity; MPN: 282837-2; OPERATING_TEMPERATURE: -40°C to +105°C; PART_STATUS: ACTIVE; ROHS_COMPLIANCE: RoHS Compliant; SERIES: 282837; SUBCATEGORY: Terminal Block; TYPE: Side Wire Entry
U$2 U$3 = Connector:2828XX-3: 3 Position Wire to Board Terminal Block Horizontal with Board Datasheet <https://www.te.com.cn/commerce/DocumentDelivery/DDEController?Action=showdoc&DocId=Catalog+Section%7F1308389_EUROSTYLE_TERMINAL_BLOCKS%7F0607%7Fpdf%7FEnglish%7FENG_CS_1308389_EUROSTYLE_TERMINAL_BLOCKS_0607.pdf%7F2-282837-5>; CATEGORY: Connector; DESCRIPTION: TERM BLK 3P SIDE ENT 5.08mm PCB; MANUFACTURER: TE Connectivity; MPN: 282837-3; OPERATING_TEMPERATURE: -40°C to +105°C; PART_STATUS: Active; ROHS_COMPLIANCE: RoHS Compliant; SERIES: 282837; SUBCATEGORY: Terminal Block; TYPE: Side Wire Entry